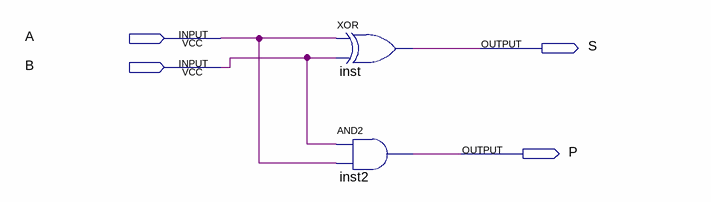
[diagram p0: schematic sheet]
// Quartus schematic summator.bdf as structural Verilog: 2 symbols, 4 pins
module summator (
  input  A,
  input  B,
  output S,
  output P
);

  xor inst (S, A, B);
  and inst2 (P, B, A);
endmodule
